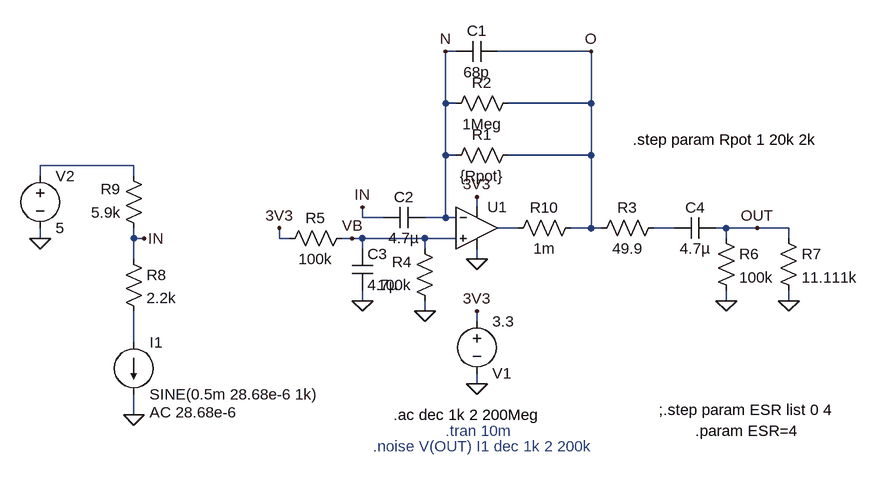
[diagram p0: schematic Preamp2.asc]
Preamp2.asc, the LTspice schematic file:
Version 4
SHEET 1 2088 680
WIRE 176 -144 160 -144
WIRE 384 -144 240 -144
WIRE 160 -64 160 -144
WIRE 176 -64 160 -64
WIRE 384 -64 384 -144
WIRE 384 -64 256 -64
WIRE 160 16 160 -64
WIRE 176 16 160 16
WIRE 384 16 384 -64
WIRE 384 16 256 16
WIRE -320 32 -464 32
WIRE -464 48 -464 32
WIRE -320 48 -320 32
WIRE 208 96 208 80
WIRE 32 112 32 96
WIRE 64 112 32 112
WIRE 160 112 160 16
WIRE 160 112 128 112
WIRE 176 112 160 112
WIRE 272 128 240 128
WIRE 384 128 384 16
WIRE 384 128 352 128
WIRE 400 128 384 128
WIRE 512 128 480 128
WIRE 592 128 576 128
WIRE 640 128 592 128
WIRE 688 128 640 128
WIRE -464 144 -464 128
WIRE -320 144 -320 128
WIRE -304 144 -320 144
WIRE -96 144 -96 128
WIRE -80 144 -96 144
WIRE 16 144 0 144
WIRE 32 144 16 144
WIRE 128 144 32 144
WIRE 176 144 128 144
WIRE 592 144 592 128
WIRE 688 144 688 128
WIRE 32 160 32 144
WIRE 128 160 128 144
WIRE -320 176 -320 144
WIRE 208 176 208 160
WIRE 32 240 32 224
WIRE 592 240 592 224
WIRE 688 240 688 224
WIRE 128 256 128 240
WIRE 208 272 208 256
WIRE -320 304 -320 256
WIRE 208 368 208 352
WIRE -320 416 -320 384
FLAG 208 176 0
FLAG 208 368 0
FLAG 208 256 3V3
FLAG 208 80 3V3
FLAG 32 240 0
FLAG -96 128 3V3
FLAG 592 240 0
FLAG 688 240 0
FLAG 16 144 VB
FLAG 32 96 IN
FLAG 160 -144 N
FLAG 384 -144 O
FLAG 640 128 OUT
FLAG 128 256 0
FLAG -320 416 0
FLAG -304 144 IN
FLAG -464 144 0
SYMBOL OpAmps\\UniversalOpAmp2 208 128 R0
SYMATTR InstName U1
SYMBOL voltage 208 256 R0
WINDOW 0 24 96 Left 2
WINDOW 3 24 16 Left 2
WINDOW 123 0 0 Left 0
WINDOW 39 0 0 Left 0
SYMATTR InstName V1
SYMATTR Value 3.3
SYMBOL res 272 0 R90
WINDOW 0 0 56 VBottom 2
WINDOW 3 32 56 VTop 2
SYMATTR InstName R1
SYMATTR Value {Rpot}
SYMBOL res 272 -80 R90
WINDOW 0 0 56 VBottom 2
WINDOW 3 32 56 VTop 2
SYMATTR InstName R2
SYMATTR Value 1Meg
SYMBOL res 496 112 R90
WINDOW 0 0 56 VBottom 2
WINDOW 3 32 56 VTop 2
SYMATTR InstName R3
SYMATTR Value 49.9
SYMBOL cap 240 -160 R90
WINDOW 0 0 32 VBottom 2
WINDOW 3 32 32 VTop 2
SYMATTR InstName C1
SYMATTR Value 68p
SYMBOL cap 128 96 R90
WINDOW 0 0 32 VBottom 2
WINDOW 3 32 32 VTop 2
SYMATTR InstName C2
SYMATTR Value 4.7µ
SYMATTR SpiceLine Rser={ESR}
SYMBOL res 144 256 R180
WINDOW 0 36 76 Left 2
WINDOW 3 36 40 Left 2
SYMATTR InstName R4
SYMATTR Value 100k
SYMBOL res 16 128 R90
WINDOW 0 0 56 VBottom 2
WINDOW 3 32 56 VTop 2
SYMATTR InstName R5
SYMATTR Value 100k
SYMBOL cap 16 160 R0
SYMATTR InstName C3
SYMATTR Value 4.7µ
SYMBOL cap 576 112 R90
WINDOW 0 0 32 VBottom 2
WINDOW 3 32 32 VTop 2
SYMATTR InstName C4
SYMATTR Value 4.7µ
SYMATTR SpiceLine Rser={ESR}
SYMBOL res 576 128 R0
SYMATTR InstName R6
SYMATTR Value 100k
SYMBOL res 672 128 R0
SYMATTR InstName R7
SYMATTR Value 11.111k
SYMBOL res -304 144 R180
WINDOW 0 36 76 Left 2
WINDOW 3 36 40 Left 2
SYMATTR InstName R9
SYMATTR Value 5.9k
SYMBOL current -320 304 R0
WINDOW 123 24 108 Left 2
WINDOW 39 0 0 Left 0
SYMATTR Value2 AC 28.68e-6
SYMATTR InstName I1
SYMATTR Value SINE(0.5m 28.68e-6 1k)
SYMBOL voltage -464 32 R0
WINDOW 123 0 0 Left 0
WINDOW 39 0 0 Left 0
SYMATTR InstName V2
SYMATTR Value 5
SYMBOL res -336 160 R0
SYMATTR InstName R8
SYMATTR Value 2.2k
SYMBOL res 368 112 R90
WINDOW 0 0 56 VBottom 2
WINDOW 3 32 56 VTop 2
SYMATTR InstName R10
SYMATTR Value 1m
TEXT 80 416 Left 2 !.ac dec 1k 2 200Meg
TEXT 160 440 Left 2 ;.tran 10m
TEXT 48 464 Left 2 ;.noise V(OUT) I1 dec 1k 2 200k
TEXT 488 408 Left 2 !;.step param ESR list 0 4
TEXT 544 440 Left 2 !.param ESR=4
TEXT 448 -8 Left 2 !.step param Rpot 1 20k 2k

The netlist it stands for:
* Preamp2.asc
XU1 VB N 3V3 0 N002 level2 Avol=1Meg GBW=10Meg Slew=10Meg Ilimit=25m Rail=0 Vos=0 En=0 Enk=0 In=0 Ink=0 Rin=500Meg  ; pins In+ In- V+ V- OUT
V1 3V3 0 3.3
R1 O N {Rpot}
R2 O N 1Meg
R3 N003 O 49.9
C1 O N 68p
C2 N IN 4.7µ Rser={ESR}
R4 0 VB 100k
R5 VB 3V3 100k
C3 VB 0 4.7µ
C4 OUT N003 4.7µ Rser={ESR}
R6 OUT 0 100k
R7 OUT 0 11.111k
R9 IN N001 5.9k
I1 N004 0 SINE(0.5m 28.68e-6 1k) AC 28.68e-6
V2 N001 0 5
R8 IN N004 2.2k
R10 O N002 1m
.ac dec 1k 2 200Meg
* .tran 10m
* .noise V(OUT) I1 dec 1k 2 200k
;.step param ESR list 0 4
.param ESR=4
.step param Rpot 1 20k 2k
.lib UniversalOpAmp2.lib
.backanno
.end